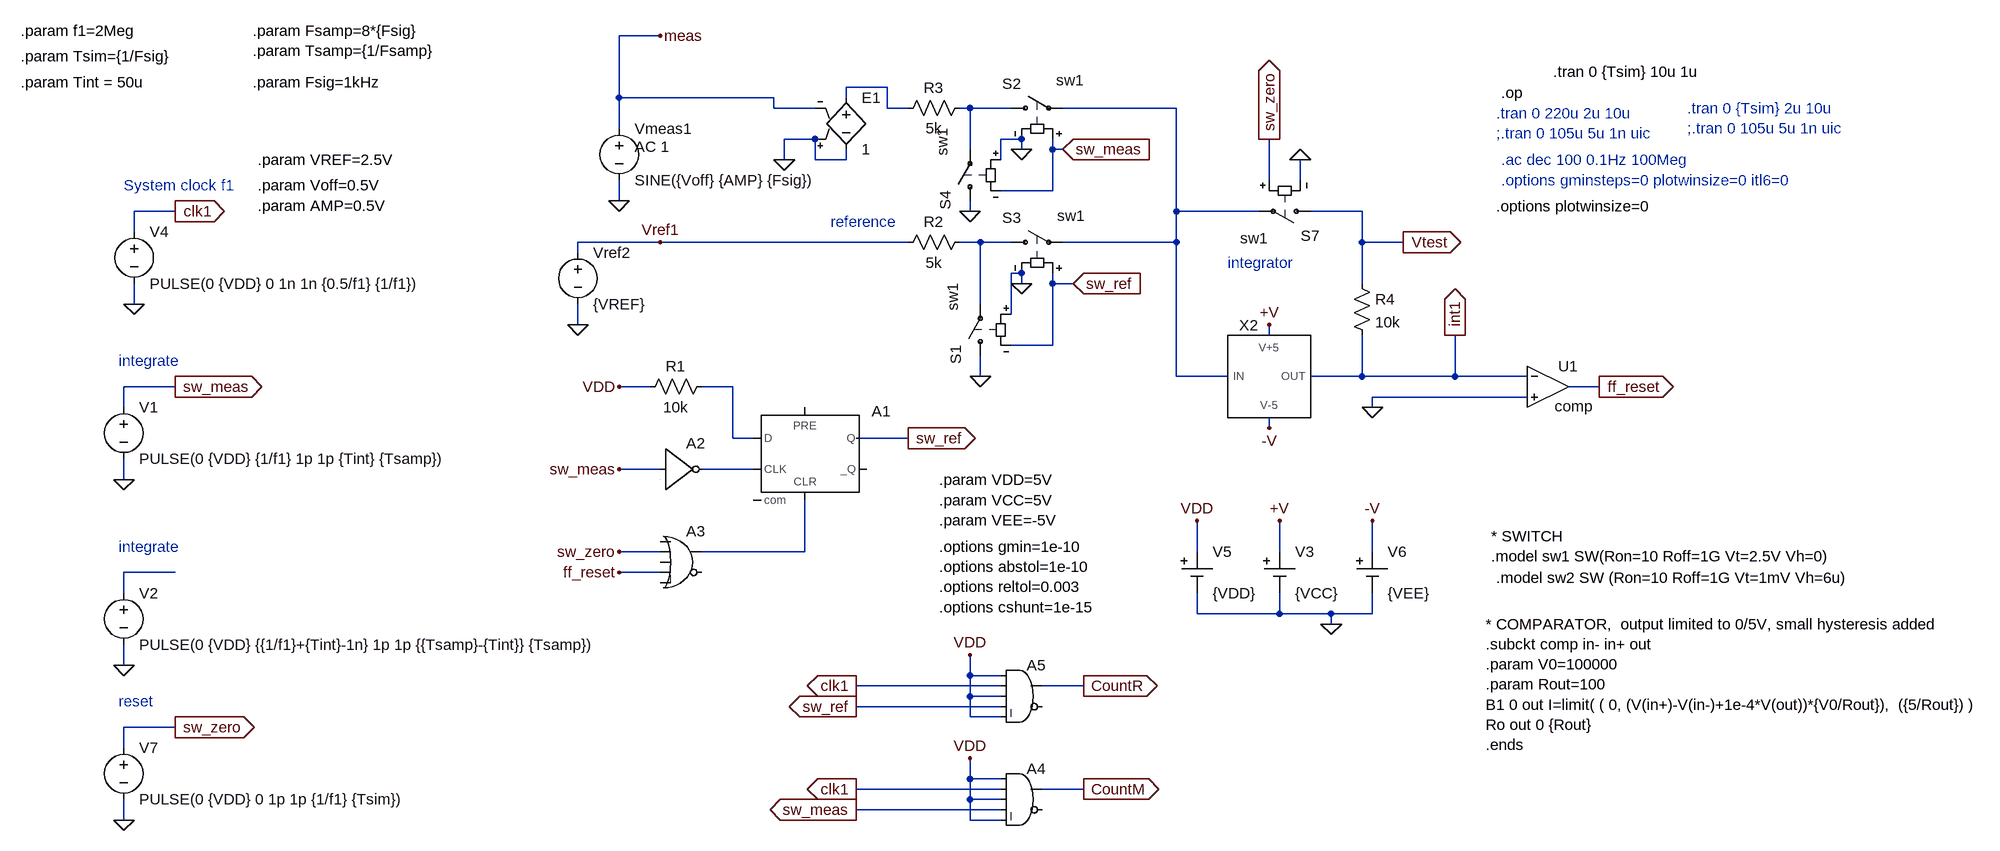
[diagram p0: schematic Dualslope_JohnInt_RJI_v1b.asc]
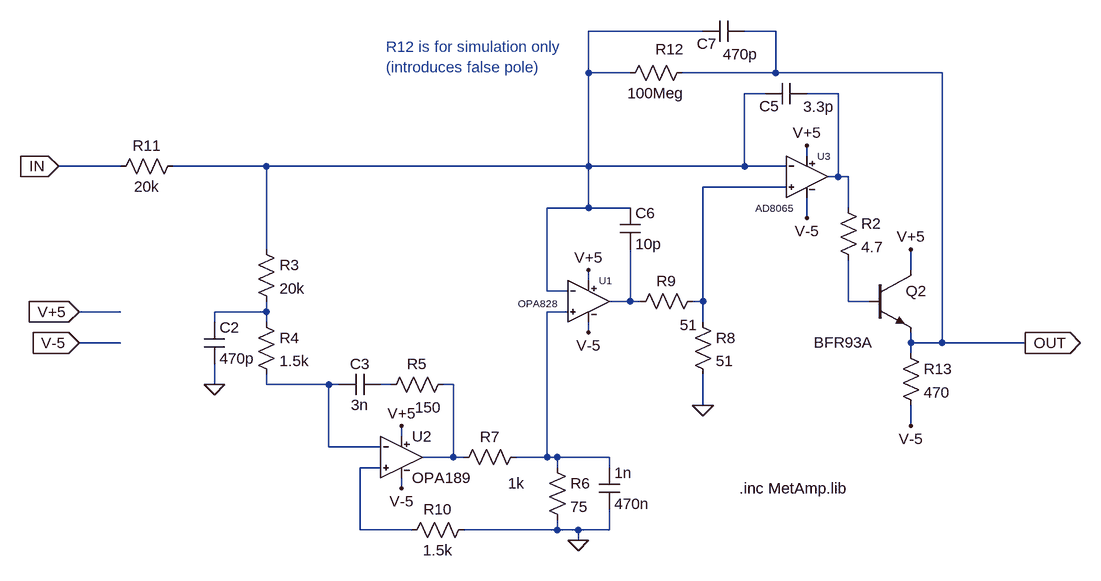
[diagram p1: sub-circuit 3_amp_int_drafta_mod.asc]
Dualslope_JohnInt_RJI_v1b.asc, the LTspice schematic file:
Version 4
SHEET 1 1640 1012
WIRE -544 -608 -608 -608
WIRE -192 -528 -256 -528
WIRE -608 -512 -608 -608
WIRE -368 -512 -608 -512
WIRE -256 -512 -256 -528
WIRE -368 -496 -368 -512
WIRE -304 -496 -368 -496
WIRE -192 -496 -192 -528
WIRE -160 -496 -192 -496
WIRE -64 -496 -80 -496
WIRE 0 -496 -64 -496
WIRE 256 -496 80 -496
WIRE -608 -464 -608 -512
WIRE -304 -448 -352 -448
WIRE 16 -448 -16 -448
WIRE -64 -432 -64 -496
WIRE 16 -432 16 -448
WIRE 64 -432 64 -448
WIRE 80 -432 64 -432
WIRE -352 -416 -352 -448
WIRE -304 -416 -304 -448
WIRE -256 -416 -256 -432
WIRE -256 -416 -304 -416
WIRE -16 -416 -16 -448
WIRE 400 -384 400 -448
WIRE 448 -384 448 -416
WIRE 64 -368 64 -432
WIRE 64 -368 -16 -368
WIRE -608 -352 -608 -384
WIRE -1296 -336 -1360 -336
WIRE -64 -336 -64 -352
WIRE 256 -336 256 -496
WIRE 384 -336 256 -336
WIRE 544 -336 464 -336
WIRE -1360 -304 -1360 -336
WIRE -544 -288 -672 -288
WIRE -160 -288 -544 -288
WIRE -48 -288 -80 -288
WIRE 0 -288 -48 -288
WIRE 256 -288 256 -336
WIRE 256 -288 80 -288
WIRE 544 -288 544 -336
WIRE 608 -288 544 -288
WIRE -672 -272 -672 -288
WIRE 16 -240 0 -240
WIRE 16 -224 16 -240
WIRE 64 -224 64 -240
WIRE 96 -224 64 -224
WIRE 544 -224 544 -288
WIRE -1360 -192 -1360 -224
WIRE -48 -192 -48 -288
WIRE 0 -176 0 -240
WIRE -672 -160 -672 -192
WIRE 400 -144 400 -160
WIRE 64 -128 64 -224
WIRE 64 -128 0 -128
WIRE -48 -80 -48 -112
WIRE 256 -80 256 -288
WIRE 336 -80 256 -80
WIRE 544 -80 544 -144
WIRE 544 -80 464 -80
WIRE 688 -80 688 -144
WIRE 688 -80 544 -80
WIRE 800 -80 688 -80
WIRE -1296 -64 -1376 -64
WIRE -560 -64 -608 -64
WIRE -432 -64 -480 -64
WIRE 912 -64 864 -64
WIRE 800 -48 560 -48
WIRE -1376 -32 -1376 -64
WIRE 560 -32 560 -48
WIRE 400 0 400 -16
WIRE -432 16 -432 -64
WIRE -400 16 -432 16
WIRE -160 16 -240 16
WIRE -544 64 -608 64
WIRE -400 64 -480 64
WIRE -1376 80 -1376 48
WIRE -544 192 -608 192
WIRE -320 192 -320 112
WIRE -320 192 -480 192
WIRE 288 192 288 144
WIRE 416 192 416 144
WIRE 560 192 560 144
WIRE -1296 224 -1376 224
WIRE -544 224 -608 224
WIRE -1376 256 -1376 224
WIRE 288 288 288 256
WIRE 416 288 416 256
WIRE 416 288 288 288
WIRE 496 288 416 288
WIRE 560 288 560 256
WIRE 560 288 496 288
WIRE 496 304 496 288
WIRE -1376 368 -1376 336
WIRE -64 384 -64 352
WIRE -16 384 -64 384
WIRE -16 400 -240 400
WIRE 112 400 48 400
WIRE -64 416 -64 384
WIRE -16 416 -64 416
WIRE -16 432 -240 432
WIRE -64 448 -64 416
WIRE -16 448 -64 448
WIRE -1296 464 -1376 464
WIRE -1376 496 -1376 464
WIRE -64 544 -64 512
WIRE -16 544 -64 544
WIRE -16 560 -240 560
WIRE 112 560 48 560
WIRE -64 576 -64 544
WIRE -16 576 -64 576
WIRE -16 592 -240 592
WIRE -1376 608 -1376 576
WIRE -64 608 -64 576
WIRE -16 608 -64 608
FLAG 16 -432 0
FLAG 16 -224 0
FLAG 80 -432 sw_meas
IOPIN 80 -432 In
FLAG 96 -224 sw_ref
IOPIN 96 -224 In
FLAG -608 -352 0
FLAG -672 -160 0
FLAG -1376 368 0
FLAG -1296 -336 clk1
IOPIN -1296 -336 Out
FLAG -1360 -192 0
FLAG -544 -608 meas
FLAG 688 -144 int1
IOPIN 688 -144 Out
FLAG -352 -416 0
FLAG 496 304 0
FLAG 416 144 +V
FLAG 560 144 -V
FLAG 400 -160 +V
FLAG 400 0 -V
FLAG -1376 80 0
FLAG -1296 -64 sw_meas
IOPIN -1296 -64 Out
FLAG -608 -64 VDD
FLAG -608 64 sw_meas
FLAG -608 224 ff_reset
FLAG -608 192 sw_zero
FLAG 288 144 VDD
FLAG -160 16 sw_ref
IOPIN -160 16 Out
FLAG -1376 608 0
FLAG -1296 464 sw_zero
IOPIN -1296 464 Out
FLAG -64 -336 0
FLAG -48 -80 0
FLAG 912 -64 ff_reset
IOPIN 912 -64 Out
FLAG 560 -32 0
FLAG 400 -448 sw_zero
IOPIN 400 -448 Out
FLAG 608 -288 Vtest
IOPIN 608 -288 Out
FLAG -544 -288 Vref1
FLAG 448 -416 0
FLAG 112 560 CountM
IOPIN 112 560 Out
FLAG -240 560 clk1
IOPIN -240 560 Out
FLAG -240 592 sw_meas
IOPIN -240 592 Out
FLAG -64 512 VDD
FLAG 112 400 CountR
IOPIN 112 400 Out
FLAG -240 400 clk1
IOPIN -240 400 Out
FLAG -240 432 sw_ref
IOPIN -240 432 Out
FLAG -64 352 VDD
SYMBOL sw -16 -496 R270
WINDOW 0 38 2 VRight 2
WINDOW 3 43 86 VRight 2
SYMATTR InstName S2
SYMATTR Value sw1
SYMBOL sw -16 -288 R270
WINDOW 0 38 2 VRight 2
WINDOW 3 41 87 VRight 2
SYMATTR InstName S3
SYMATTR Value sw1
SYMBOL voltage -608 -480 R0
WINDOW 123 24 44 Left 2
WINDOW 39 0 0 Left 0
SYMATTR Value2 AC 1
SYMATTR InstName Vmeas1
SYMATTR Value SINE({Voff} {AMP} {Fsig})
SYMBOL voltage -672 -288 R0
WINDOW 123 0 0 Left 0
WINDOW 39 0 0 Left 0
SYMATTR InstName Vref2
SYMATTR Value {VREF}
SYMBOL voltage -1376 240 R0
WINDOW 123 0 0 Left 0
WINDOW 39 0 0 Left 0
SYMATTR InstName V2
SYMATTR Value PULSE(0 {VDD} {{1/f1}+{Tint}-1n} 1p 1p {{Tsamp}-{Tint}} {Tsamp})
SYMBOL voltage -1360 -320 R0
WINDOW 123 0 0 Left 0
WINDOW 39 0 0 Left 0
SYMATTR InstName V4
SYMATTR Value PULSE(0 {VDD} 0 1n 1n {0.5/f1} {1/f1})
SYMBOL e2 -256 -528 R0
SYMATTR InstName E1
SYMATTR Value 1
SYMBOL Misc\\cell 416 192 R0
SYMATTR InstName V3
SYMATTR Value {VCC}
SYMBOL Misc\\cell 560 192 R0
SYMATTR InstName V6
SYMATTR Value {VEE}
SYMBOL voltage -1376 -48 R0
WINDOW 123 0 0 Left 0
WINDOW 39 0 0 Left 0
SYMATTR InstName V1
SYMATTR Value PULSE(0 {VDD} {1/f1} 1p 1p {Tint} {Tsamp})
SYMBOL Digital\\dflop -320 -32 R0
SYMATTR InstName A1
SYMATTR Value2 td=0.1n
SYMATTR SpiceLine Vhigh={VDD}
SYMBOL Digital\\inv -544 0 R0
SYMATTR InstName A2
SYMATTR SpiceLine Vhigh={VDD}
SYMBOL res -576 -48 R270
WINDOW 0 32 56 VTop 2
WINDOW 3 0 56 VBottom 2
SYMATTR InstName R1
SYMATTR Value 10k
SYMBOL Digital\\or -512 144 R0
SYMATTR InstName A3
SYMATTR SpiceLine Vhigh={VDD}
SYMBOL Misc\\cell 288 192 R0
SYMATTR InstName V5
SYMATTR Value {VDD}
SYMBOL voltage -1376 480 R0
WINDOW 123 0 0 Left 0
WINDOW 39 0 0 Left 0
SYMATTR InstName V7
SYMATTR Value PULSE(0 {VDD} 0 1p 1p {1/f1} {Tsim})
SYMBOL res -64 -304 R90
WINDOW 0 0 56 VBottom 2
WINDOW 3 32 56 VTop 2
SYMATTR InstName R2
SYMATTR Value 5k
SYMBOL res -64 -512 R90
WINDOW 0 0 56 VBottom 2
WINDOW 3 32 56 VTop 2
SYMATTR InstName R3
SYMATTR Value 5k
SYMBOL sw -48 -96 R180
WINDOW 0 38 2 VRight 2
WINDOW 3 43 86 VRight 2
SYMATTR InstName S1
SYMATTR Value sw1
SYMBOL sw -64 -336 R180
WINDOW 0 38 2 VRight 2
WINDOW 3 43 86 VRight 2
SYMATTR InstName S4
SYMATTR Value sw1
SYMBOL sw 480 -336 R90
WINDOW 0 38 2 VRight 2
WINDOW 3 42 82 VRight 2
SYMATTR InstName S7
SYMATTR Value sw1
SYMBOL res 528 -240 R0
SYMATTR InstName R4
SYMATTR Value 10k
SYMBOL Opamps\\opamp 832 -128 R0
WINDOW 3 11 94 Left 2
SYMATTR Value comp
SYMATTR InstName U1
SYMBOL 3_amp_int_drafta_mod 400 -80 R0
SYMATTR InstName X2
SYMBOL Digital\\and 16 512 R0
SYMATTR InstName A4
SYMATTR SpiceLine Vhigh={VDD}
SYMBOL Digital\\and 16 352 R0
SYMATTR InstName A5
SYMATTR SpiceLine Vhigh={VDD}
TEXT 752 -344 Left 2 !.options plotwinsize=0
TEXT 744 168 Left 2 !* SWITCH\n.model sw1 SW(Ron=10 Roff=1G Vt=2.5V Vh=0)
TEXT -1376 -376 Left 2 ;System clock f1
TEXT -1384 184 Left 2 ;integrate
TEXT 336 -256 Left 2 ;integrator
TEXT -280 -320 Left 2 ;reference
TEXT 760 -416 Left 2 ;.ac dec 100 0.1Hz 100Meg
TEXT -1536 -616 Left 2 !.param f1=2Meg
TEXT -1536 -576 Left 2 !.param Tsim={1/Fsig}
TEXT -1536 -536 Left 2 !.param Tint = 50u
TEXT -1176 -616 Left 2 !.param Fsamp=8*{Fsig}\n.param Tsamp={1/Fsamp}
TEXT -1176 -536 Left 2 !.param Fsig=1kHz
TEXT -112 80 Left 2 !.param VDD=5V
TEXT -1168 -376 Left 2 !.param Voff=0.5V\n.param AMP=0.5V
TEXT 752 232 Left 2 !.model sw2 SW (Ron=10 Roff=1G Vt=1mV Vh=6u)
TEXT -1168 -416 Left 2 !.param VREF=2.5V
TEXT -112 112 Left 2 !.param VCC=5V\n.param VEE=-5V
TEXT 760 -384 Left 2 ;.options gminsteps=0 plotwinsize=0 itl6=0
TEXT 760 -520 Left 2 !.op
TEXT 752 -488 Left 2 ;.tran 0 220u 2u 10u\n;.tran 0 105u 5u 1n uic
TEXT -1384 -104 Left 2 ;integrate
TEXT -1384 424 Left 2 ;reset
TEXT 1048 -496 Left 2 ;.tran 0 {Tsim} 2u 10u\n;.tran 0 105u 5u 1n uic
TEXT 840 -552 Left 2 !.tran 0 {Tsim} 10u 1u
TEXT -112 184 Left 2 !.options gmin=1e-10\n.options abstol=1e-10\n.options reltol=0.003\n.options cshunt=1e-15
TEXT 736 304 Left 2 !* COMPARATOR,  output limited to 0/5V, small hysteresis added\n.subckt comp in- in+ out\n.param V0=100000\n.param Rout=100\nB1 0 out I=limit( ( 0, (V(in+)-V(in-)+1e-4*V(out))*{V0/Rout}),  ({5/Rout}) )\nRo out 0 {Rout}\n.ends

3_amp_int_drafta_mod.asc, the sub-circuit schematic file:
Version 4
SHEET 1 1476 680
WIRE 464 -256 288 -256
WIRE 576 -256 528 -256
WIRE 288 -192 288 -256
WIRE 352 -192 288 -192
WIRE 576 -192 576 -256
WIRE 576 -192 432 -192
WIRE 832 -192 576 -192
WIRE 560 -160 528 -160
WIRE 672 -160 624 -160
WIRE 624 -64 624 -80
WIRE -432 -48 -528 -48
WIRE -208 -48 -352 -48
WIRE 288 -48 288 -192
WIRE 288 -48 -208 -48
WIRE 528 -48 528 -160
WIRE 528 -48 288 -48
WIRE 592 -48 528 -48
WIRE 672 -32 672 -160
WIRE 672 -32 656 -32
WIRE 688 -32 672 -32
WIRE 592 -16 464 -16
WIRE 288 16 288 -48
WIRE 288 16 224 16
WIRE 352 16 288 16
WIRE 688 16 688 -32
WIRE 624 32 624 0
WIRE -208 80 -208 -48
WIRE 784 112 784 80
WIRE 288 128 288 112
WIRE 224 144 224 16
WIRE 256 144 224 144
WIRE 352 160 352 80
WIRE 352 160 320 160
WIRE 368 160 352 160
WIRE 464 160 464 -16
WIRE 464 160 448 160
WIRE 688 160 688 96
WIRE 720 160 688 160
WIRE -432 176 -496 176
WIRE -208 176 -208 160
WIRE -208 176 -288 176
WIRE 256 176 224 176
WIRE -288 192 -288 176
WIRE -208 192 -208 176
WIRE 464 192 464 160
WIRE 288 208 288 192
WIRE -432 224 -496 224
WIRE 784 224 784 208
WIRE 832 224 832 -192
WIRE 832 224 784 224
WIRE 960 224 832 224
WIRE 784 240 784 224
WIRE -288 288 -288 256
WIRE -208 288 -208 272
WIRE -112 288 -208 288
WIRE -96 288 -112 288
WIRE -16 288 -32 288
WIRE 80 288 64 288
WIRE 464 320 464 272
WIRE 784 352 784 320
WIRE 0 368 0 352
WIRE -112 384 -112 288
WIRE -32 384 -112 384
WIRE 80 400 80 288
WIRE 80 400 32 400
WIRE 96 400 80 400
WIRE 224 400 224 176
WIRE 224 400 176 400
WIRE 240 400 224 400
WIRE 320 400 240 400
WIRE -32 416 -64 416
WIRE 240 416 240 400
WIRE 320 416 320 400
WIRE 0 448 0 432
WIRE -64 512 -64 416
WIRE 16 512 -64 512
WIRE 240 512 240 496
WIRE 240 512 96 512
WIRE 272 512 240 512
WIRE 320 512 320 480
WIRE 320 512 272 512
WIRE 272 528 272 512
FLAG 464 320 0
FLAG 272 528 0
FLAG 624 -80 V+5
FLAG 624 32 V-5
FLAG 0 352 V+5
FLAG 288 112 V+5
FLAG 288 208 V-5
FLAG 0 448 V-5
FLAG -288 288 0
FLAG 784 80 V+5
FLAG 784 352 V-5
FLAG -528 -48 IN
IOPIN -528 -48 In
FLAG 960 224 OUT
IOPIN 960 224 Out
FLAG -496 176 V+5
IOPIN -496 176 In
FLAG -496 224 V-5
IOPIN -496 224 In
SYMBOL res -224 64 R0
SYMATTR InstName R3
SYMATTR Value 20k
SYMBOL res -224 176 R0
SYMATTR InstName R4
SYMATTR Value 1.5k
SYMBOL res 80 272 R90
WINDOW 0 0 56 VBottom 2
WINDOW 3 36 39 VTop 2
SYMATTR InstName R5
SYMATTR Value 150
SYMBOL cap -32 272 R90
WINDOW 0 0 32 VBottom 2
WINDOW 3 32 32 VTop 2
SYMATTR InstName C3
SYMATTR Value 3n
SYMATTR Value2 IC=0
SYMBOL res 224 400 R0
SYMATTR InstName R6
SYMATTR Value 75
SYMBOL cap 304 416 R0
SYMATTR InstName 1n
SYMATTR Value 470n
SYMBOL res 192 384 R90
WINDOW 0 0 56 VBottom 2
WINDOW 3 41 15 VTop 2
SYMATTR InstName R7
SYMATTR Value 1k
SYMBOL res 448 176 R0
SYMATTR InstName R8
SYMATTR Value 51
SYMBOL res 464 144 R90
WINDOW 0 0 56 VBottom 2
WINDOW 3 37 22 VTop 2
SYMATTR InstName R9
SYMATTR Value 51
SYMBOL cap 624 -176 R90
WINDOW 0 51 58 VBottom 2
WINDOW 3 21 -18 VTop 2
SYMATTR InstName C5
SYMATTR Value 3.3p
SYMBOL res 112 496 R90
WINDOW 0 0 56 VBottom 2
WINDOW 3 32 56 VTop 2
SYMATTR InstName R10
SYMATTR Value 1.5k
SYMBOL res -336 -64 R90
WINDOW 0 0 56 VBottom 2
WINDOW 3 32 56 VTop 2
SYMATTR InstName R11
SYMATTR Value 20k
SYMBOL res 448 -208 R90
WINDOW 0 -5 35 VBottom 2
WINDOW 3 32 56 VTop 2
SYMATTR InstName R12
SYMATTR Value 100Meg
SYMBOL cap -304 192 R0
SYMATTR InstName C2
SYMATTR Value 470p
SYMBOL res 672 0 R0
SYMATTR InstName R2
SYMATTR Value 4.7
SYMBOL npn 720 112 R0
WINDOW 3 -85 111 Left 2
SYMATTR Value BFR93A
SYMATTR InstName Q2
SYMBOL res 768 224 R0
SYMATTR InstName R13
SYMATTR Value 470
SYMBOL cap 528 -272 R90
WINDOW 0 51 58 VBottom 2
WINDOW 3 36 6 VTop 2
SYMATTR InstName C7
SYMATTR Value 470p
SYMATTR Value2 IC=0
SYMBOL cap 336 16 R0
SYMATTR InstName C6
SYMATTR Value 10p
SYMBOL OPA189 0 336 R0
SYMATTR InstName U2
SYMBOL AD8065 624 -96 R0
WINDOW 3 -79 112 Left 1
SYMATTR InstName U3
SYMBOL OPA828 288 96 R0
WINDOW 3 -109 67 Left 1
SYMATTR InstName U1
TEXT -24 -232 Left 2 ;R12 is for simulation only\n(introduces false pole)
TEXT 520 448 Left 2 !.inc MetAmp.lib

The netlist it stands for:
* Dualslope_JohnInt_RJI_v1b.asc
S2 N002 N003 sw_meas 0 sw1
S3 N004 N003 sw_ref 0 sw1
Vmeas1 meas 0 SINE({Voff} {AMP} {Fsig}) AC 1
Vref2 Vref1 0 {VREF}
V2 N008 0 PULSE(0 {VDD} {{1/f1}+{Tint}-1n} 1p 1p {{Tsamp}-{Tint}} {Tsamp})
V4 clk1 0 PULSE(0 {VDD} 0 1n 1n {0.5/f1} {1/f1})
E1 N001 0 0 meas 1
V3 +V 0 {VCC}
V6 -V 0 {VEE}
V1 sw_meas 0 PULSE(0 {VDD} {1/f1} 1p 1p {Tint} {Tsamp})
A1 N005 0 N006 0 N007 0 sw_ref 0 DFLOP td=0.1n Vhigh={VDD}
A2 sw_meas 0 0 0 0 N006 0 0 BUF Vhigh={VDD}
R1 VDD N005 10k
A3 0 sw_zero 0 ff_reset 0 0 N007 0 OR Vhigh={VDD}
V5 VDD 0 {VDD}
V7 sw_zero 0 PULSE(0 {VDD} 0 1p 1p {1/f1} {Tsim})
R2 N004 Vref1 5k
R3 N002 N001 5k
S1 0 N004 0 sw_ref sw1
S4 0 N002 0 sw_meas sw1
S7 Vtest N003 sw_zero 0 sw1
R4 Vtest int1 10k
XU1 int1 0 ff_reset comp Aol=100K GBW=10Meg  ; pins invin noninvin out
XX2 N003 +V -V int1 3_amp_int_drafta_mod
A4 VDD clk1 VDD sw_meas VDD 0 CountM 0 AND Vhigh={VDD}
A5 VDD clk1 VDD sw_ref VDD 0 CountR 0 AND Vhigh={VDD}

* block symbol definitions
.subckt 3_amp_int_drafta_mod IN V+5 V-5 OUT
R3 N001 N006 20k
R4 N006 N008 1.5k
R5 N010 N009 150
C3 N009 N008 3n IC=0
R6 N007 0 75
C§1n N007 0 470n
R7 N007 N010 1k
R8 N003 0 51
R9 N003 N004 51
C5 N002 N001 3.3p
R10 0 N011 1.5k
R11 N001 IN 20k
R12 OUT N001 100Meg
C2 N006 0 470p
R2 N002 N005 4.7
Q2 V+5 N005 OUT 0 BFR93A
R13 OUT V-5 470
C7 OUT N001 470p IC=0
C6 N001 N004 10p
XU2 N011 N008 V+5 V-5 N010 OPA189  ; pins In+ In- V+ V- OUT
XU3 N003 N001 V+5 V-5 N002 AD8065  ; pins In+ In- V+ V- OUT
XU1 N007 N001 V+5 V-5 N004 OPAx828  ; pins In+ In- V+ V- OUT
* R12 is for simulation only
* (introduces false pole)
.inc MetAmp.lib
.ends 3_amp_int_drafta_mod

.model NPN NPN
.model PNP PNP
.lib standard.bjt
.options plotwinsize=0
* SWITCH
.model sw1 SW(Ron=10 Roff=1G Vt=2.5V Vh=0)
* System clock f1
* integrate
* integrator
* reference
* .ac dec 100 0.1Hz 100Meg
.param f1=2Meg
.param Tsim={1/Fsig}
.param Tint = 50u
.param Fsamp=8*{Fsig}
.param Tsamp={1/Fsamp}
.param Fsig=1kHz
.param VDD=5V
.param Voff=0.5V
.param AMP=0.5V
.model sw2 SW (Ron=10 Roff=1G Vt=1mV Vh=6u)
.param VREF=2.5V
.param VCC=5V
.param VEE=-5V
* .options gminsteps=0 plotwinsize=0 itl6=0
.op
* .tran 0 220u 2u 10u
* ;.tran 0 105u 5u 1n uic
* integrate
* reset
* .tran 0 {Tsim} 2u 10u
* ;.tran 0 105u 5u 1n uic
.tran 0 {Tsim} 10u 1u
.options gmin=1e-10
.options abstol=1e-10
.options reltol=0.003
.options cshunt=1e-15
* COMPARATOR,  output limited to 0/5V, small hysteresis added
.subckt comp in- in+ out
.param V0=100000
.param Rout=100
B1 0 out I=limit( ( 0, (V(in+)-V(in-)+1e-4*V(out))*{V0/Rout}),  ({5/Rout}) )
Ro out 0 {Rout}
.ends
.lib MetAmp.lib
.backanno
.end